# EAGLE design brick_i2c_color (EAGLE 7.4.0)
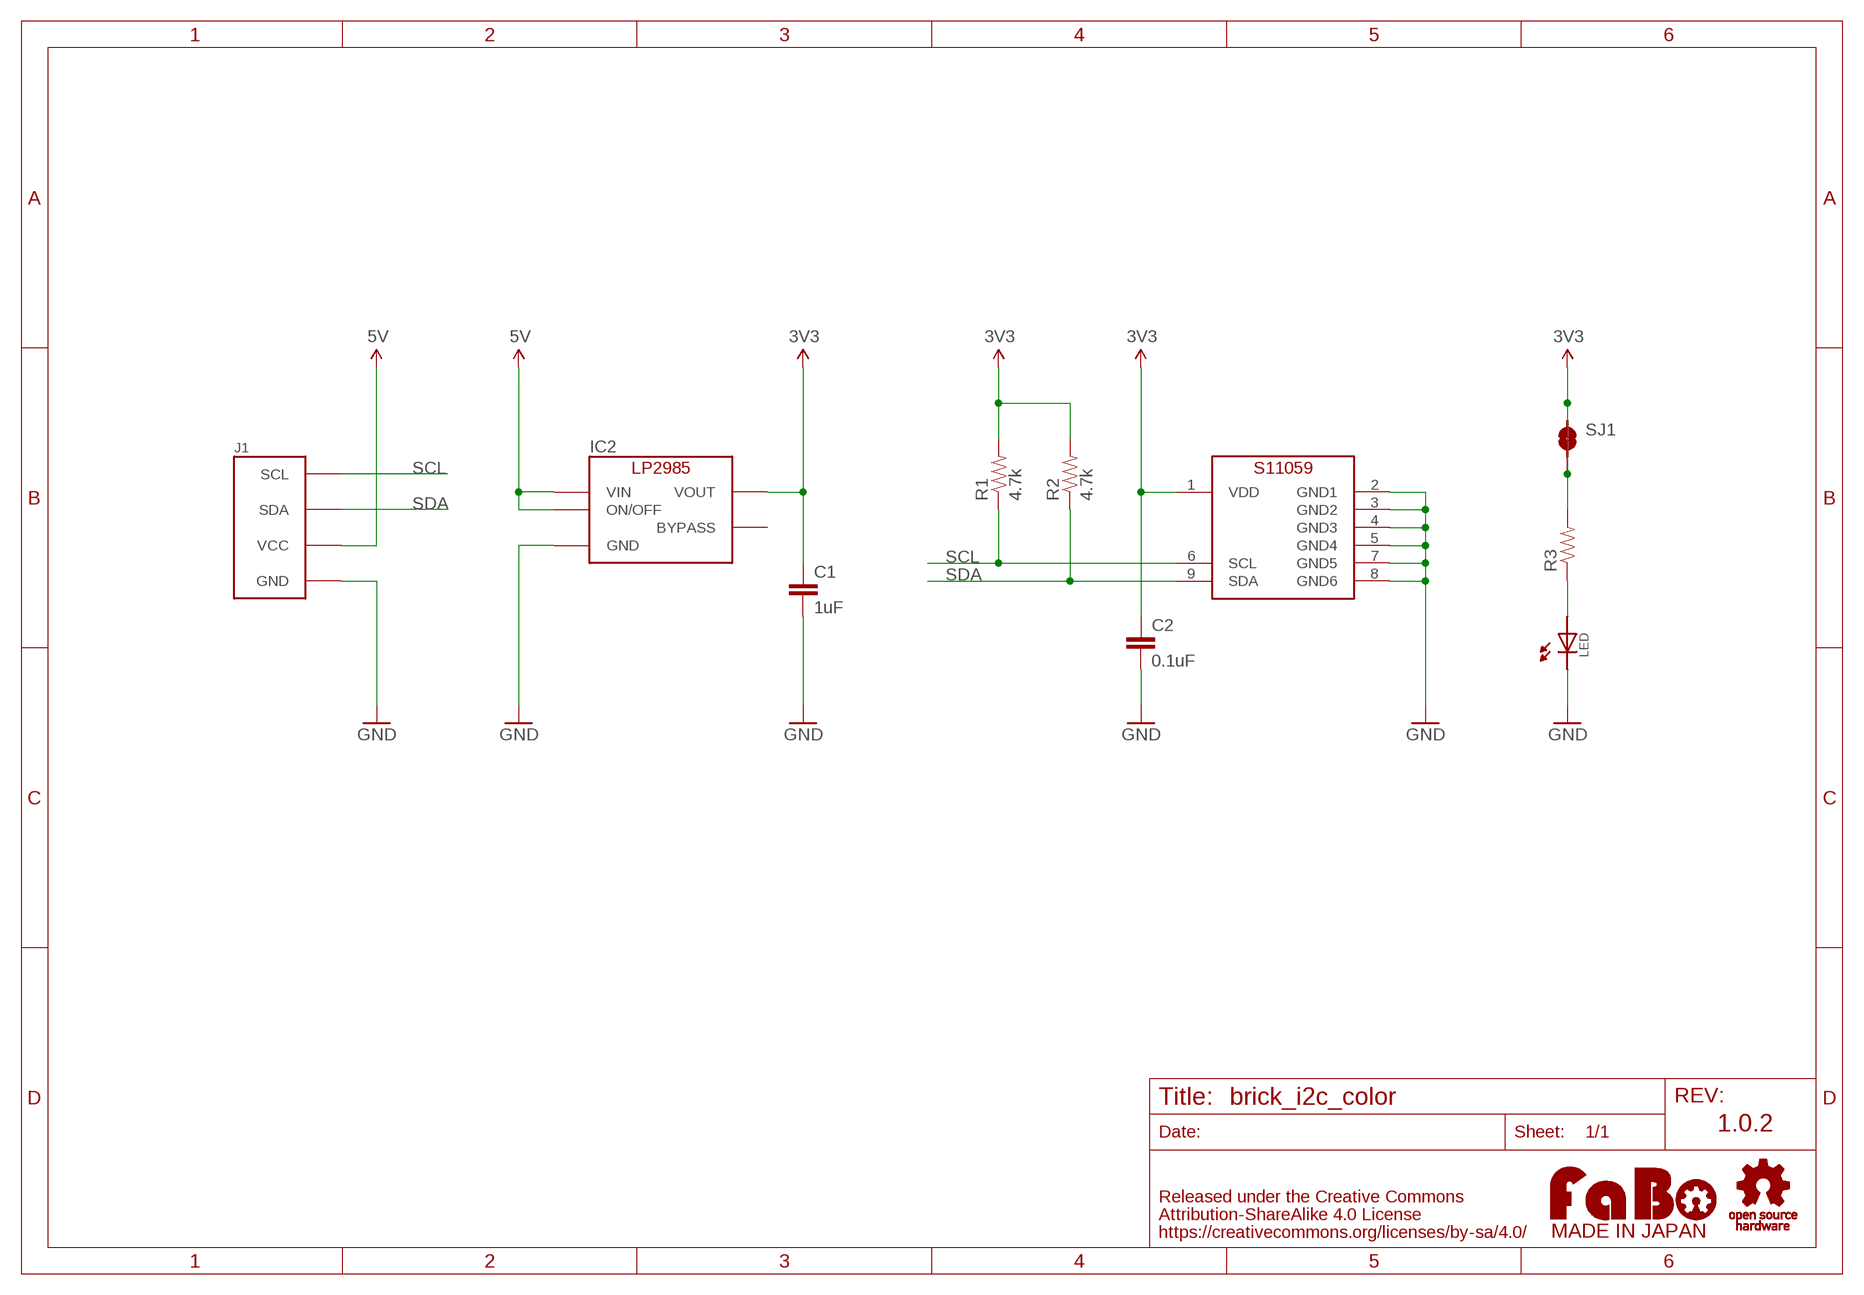
[diagram p0: schematic, sheet 1]

## Parts
C1  1uF  CAP-EIA0603  [EIA0603]
C2  0.1uF  CAP-EIA0603  [EIA0603]
IC1  HAMAMATSU-S11059  [HAMAMATSU-S11059]
IC2  TI-LP2985-33DBVR  [TI-LP2985]
J1  FABO_BRICK_I2C  [FABO_BRICK_I2C]
LED  NSSW157T  [NSSW157T]
R1  4.7k  RES-EIA0603  [EIA0603]
R2  4.7k  RES-EIA0603  [EIA0603]
R3  RES-EIA0603  [EIA0603]
SJ1  SMD-JUMPER-2  [SMD-JUMPER-2]
U$2  LOGO_OSHW-T_M  [LOGO_OSHW_T_M]
U$3  LOGO_FABO-M  [LOGO_FABO_M]

## Nets
3V3: C1.1 C2.1 IC1.1(VDD) IC2.5(VOUT) R1.2 R2.2 R3.2 SJ1.1 SJ1.2
5V: IC2.1(VIN) IC2.3(ON/OFF) J1.VCC
GND: C1.2 C2.2 IC1.2(GND1) IC1.3(GND2) IC1.4(GND3) IC1.5(GND4) IC1.7(GND5) IC1.8(GND6) IC2.2(GND) J1.GND LED.CATHODE1(CATHODE) LED.CATHODE2(CATHODE)
N$1: LED.ANODE1(ANODE) LED.ANODE2(ANODE) R3.1
SCL: IC1.6(SCL) J1.SCL R1.1
SDA: IC1.9(SDA) J1.SDA R2.1
Unconnected: IC2.4(BYPASS)

## Notes on the sheet
- 1.0.2

## Library data of the parts
C1 C2 = FaBo-etc:CAP: Capacitor Standard 0603 ceramic capacitor
IC1 = FaBo-Sensor:HAMAMATSU-S11059
IC2 = FaBo-Supply:TI-LP2985: LP2985
J1 = FaBo-Template:FABO_BRICK_I2C: FaBo Brick I2C
LED = FaBo-LED:NSSW157T
R1-R3 = FaBo-etc:RES
SJ1 = FaBo-etc:SMD-JUMPER-2
U$2 = FaBo-etc:LOGO_OSHW
U$3 = FaBo-etc:LOGO_FABO

## Board
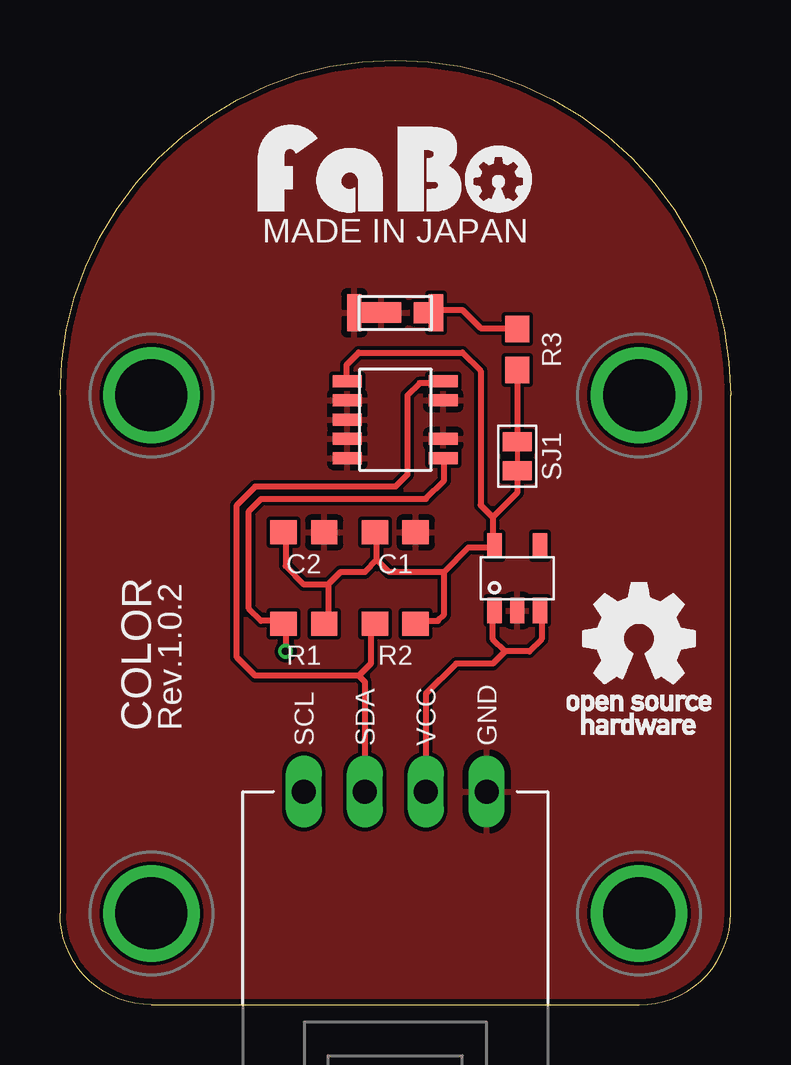
[diagram p1: board, top side]
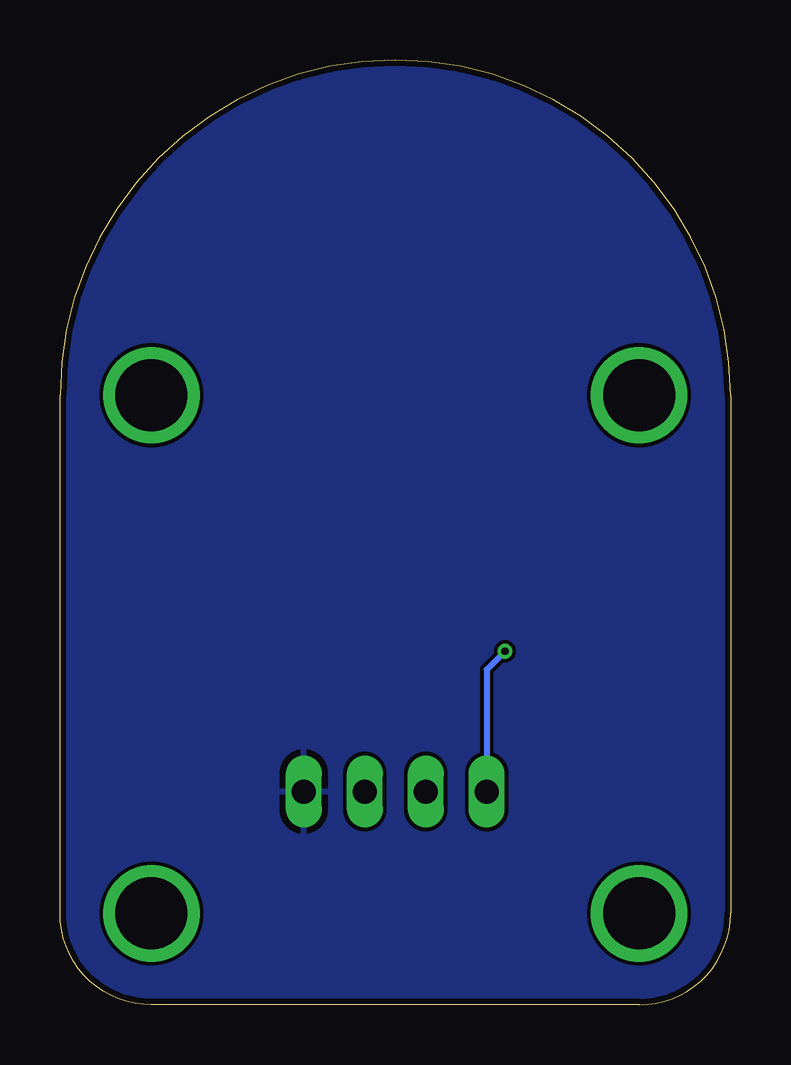
[diagram p2: board, bottom side, seen from below]

Size 27.94 x 39.37 mm. Coordinates in mm from the lower left corner, seen from the top.
Copper layers (1*16): Top 0.035mm / dielectric 1.5mm / Bottom 0.035mm
Design rules "Elecrow_2-layer_eagle_rule": minimum track width 6mil, minimum drill 12mil, track to track 6mil, track to pad 6mil, pad to pad 6mil, via to via 6mil, smd to smd 0mil, copper to edge 10mil, drill to drill 10mil, minimum pad ring 10mil, minimum via ring 6mil, stop-mask expansion 2mil, vias tented up to drill 100mil, thermal gap 10mil

### Footprints (pad centres in the part's own frame; a part is rotated, then mirrored left to right if it is on the bottom)
EIA0603 = smd 1.1 x 1: 1 -0.85,0; 2 0.85,0
HAMAMATSU-S11059 = smd 1.2 x 0.5: 1 -2,1.6; 2 -2,0.8; 3 -2,0; 4 -2,-0.8; 5 -2,-1.6; 6 2,-1.6; 7 2,-0.8; 8 2,0.8; 9 2,1.6
TI-LP2985 = smd 0.6 x 1.05: 1 -0.95,-1.35; 2 0,-1.35; 3 0.95,-1.35; 4 0.95,1.35; 5 -0.95,1.35
FABO_BRICK_I2C = drill 1 long: GND 3.81,-10.16; SCL -3.81,-10.16; SDA -1.27,-10.16; VCC 1.27,-10.16 | drill 3 pad 3.81: P$1 -10.16,6.35; P$2 10.16,6.35; P$3 -10.16,-15.24; P$4 10.16,-15.24
NSSW157T = smd 0.6 x 1.55: ANODE1 1.7,0.01; CATHODE2 -1.71,0.01 | smd 0.64 x 0.86: ANODE2 1.08,0.01 | smd 1.66 x 0.86: CATHODE1 -0.59,0.02
SMD-JUMPER-2 = smd 0.8 x 1.2: 1 -0.6,0; 2 0.6,0

### Placement (x,y rotation side)
C1  13.97,19.68 0 top
C2  10.16,19.68 0 top
IC1  13.97,24.38 0 top
IC2  19.05,17.78 0 top
J1  13.97,19.05 0 top
LED  13.97,28.83 0 top
R1  10.16,15.88 0 top
R2  13.97,15.88 0 top
R3  19.05,27.3 270 top
SJ1  19.05,22.86 90 top
U$2  24.13,15.24 0 top
U$3  13.97,33.02 0 top

### Tracks (layer width: path | path; a pad name or v marks a point on that pad's centre or on a via)
3V3
  Top 0.203: SJ1.2 SJ1.1
  Top 0.254: SJ1.1 19.05,21.34 18.03,20.32 | 18.03,20.32 18.03,19.2 | 18.03,19.2 IC2.5 | R3.2 SJ1.2 | 18.03,19.2 18.03,19.05 17.02,19.05 16,18.03 | 16,18.03 13.72,18.03 13.21,18.54 | 13.21,18.54 13.21,19.6 C1.1 | R2.2 14.86,15.88 14.99,16 15.75,16 16,16.26 16,18.03 | 13.21,18.54 12.7,18.03 11.68,18.03 11.18,17.53 | 11.18,17.53 11.18,16.04 R1.2 | C2.1 9.31,19.39 9.4,19.3 9.4,18.29 10.16,17.53 11.18,17.53 | IC1.1 11.97,25.88 11.94,25.91 11.94,26.67 12.45,27.18 16.76,27.18 17.53,26.42 17.53,20.83 18.03,20.32
5V
  Top 0.254: IC2.3 20,16.07 20.07,16 20.07,15.24 19.56,14.73 18.54,14.73 | 18.54,14.73 18.03,15.24 18.03,16.36 IC2.1 | 18.54,14.73 18.03,14.22 16.51,14.22 15.24,12.95 J1.VCC
GND
  pour Bottom: -1.27,-1.27 29.21,-1.27 29.21,40.64 -1.27,40.64
  pour Top: -1.27,-1.27 29.21,-1.27 29.21,40.64 -1.27,40.64
N$1
  Top 0.254: LED.ANODE2 LED.ANODE1 15.67,28.53 15.24,28.96 16.76,28.96 17.53,28.19 19.01,28.19 R3.1
SCL  (via drill 0.3)
  Top 0.254: IC1.6 16,22.5 16,21.84 15.24,21.08 8.38,21.08 7.87,20.57 7.87,16.51 8.38,16 8.89,16 9.02,15.88 R1.1 9.31,15.58 9.4,15.49 v9.4,14.73
  Bottom 0.254: v9.4,14.73 10.16,13.97 J1.SCL
SDA
  Top 0.254: IC1.9 15.82,25.98 15.75,25.91 14.99,25.91 14.48,25.4 14.48,22.1 13.97,21.59 8.13,21.59 7.37,20.83 7.37,14.48 8.13,13.72 12.45,13.72 | R2.1 13.08,15.88 12.95,15.75 12.95,14.22 12.45,13.72 | 12.45,13.72 12.7,13.46 J1.SDA

### Text on the board
tPlace: MADE IN JAPAN | COLOR | Rev.1.0.2